# Altium schematic sheet Adapter.SchDoc
size A4
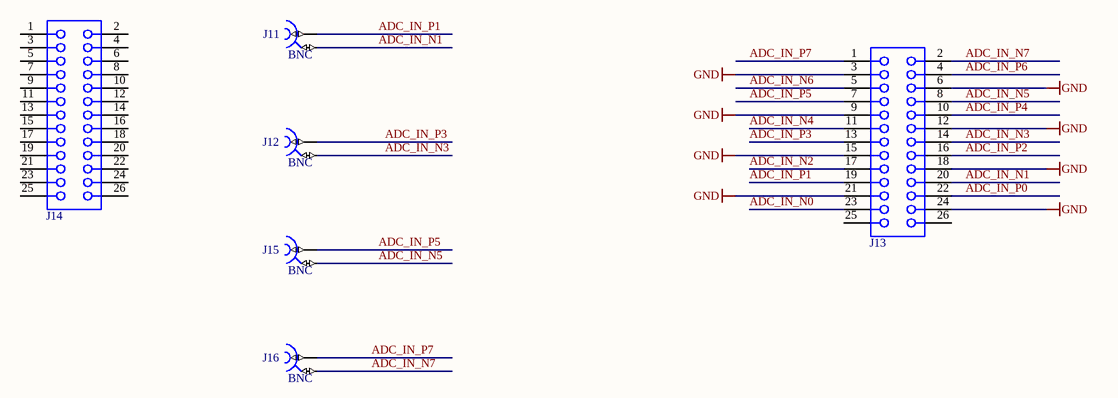
[diagram p0: Adapter.SchDoc]

## Parts
J11  BNC  [MOLEX_73251-3150]
J12  BNC  [MOLEX_73251-3150]
J13  61032621821  [61032621821]  (value not drawn)
J14  61302621821  [61302621821]  (value not drawn)
J15  BNC  [MOLEX_73251-3150]
J16  BNC  [MOLEX_73251-3150]

## Nets
GND: J13.3 J13.6 J13.9 J13.12 J13.15 J13.18 J13.21 J13.24
ADC_IN_N0: J13.23
ADC_IN_N1: J11.2 J13.20
ADC_IN_N2: J13.17
ADC_IN_N3: J12.2 J13.14
ADC_IN_N4: J13.11
ADC_IN_N5: J13.8 J15.2
ADC_IN_N6: J13.5
ADC_IN_N7: J13.2 J16.2
ADC_IN_P0: J13.22
ADC_IN_P1: J11.1 J13.19
ADC_IN_P2: J13.16
ADC_IN_P3: J12.1 J13.13
ADC_IN_P4: J13.10
ADC_IN_P5: J13.7 J15.1
ADC_IN_P6: J13.4
ADC_IN_P7: J13.1 J16.1

Not connected (* = marked no-connect by the designer): J13 25 26; J14 1 2 3 4 5 6 7 8 9 10 11 12 13 14 15 16 17 18 19 20 21 22 23 24 25 26

## Library data of the parts
J11 J12 J15 J16 = MOLEX_73251-3150: Part Description: RF Connectors / Coaxial Connectors BNC RA PCB RECPT 50 OHM; Manufacturer: MOLEX; PressFit: No; Part Number: MOLEX_73251-3150; Component Kind: Standard; Component Type: Standard; Pin Count: 5; Family: BNC; Mounted: Yes; Socket: No; SMD: No; Sense: No; Status: None; Manufacturer Part Number: 73251-3150; HelpURL: \\cern.ch\dfs\Applications\Altium\Datasheets\MOLEX_73251-2121.pdf; Author: CERN DEM JLC; CreateDate: 19.09.2024; LatestRevisionDate: 19.09.2024
J13 = 61032621821: WR-PHD Socket Header, SMT, Vertical, pitch 2.54mm, 2 Row, 26P; Manufacturer: Wurth Elektronik; Contact Resistance: 20mOhm; Rated Current: 3A; Working Voltage: 250V; Withstanding Voltage: 600V; Manufacturer Part Number: 61032621821; Category: Board-to-Board Connectors; Match Code: WR-PHD; ComponentLink1Description: Website Link; ComponentLink1URL: https://www.we-online.com/redexpert/article/61032621821?ad; ComponentLink2Description: Datasheet Link; ComponentLink2URL: https://www.we-online.com/redexpert/spec/61032621821?ad; Mount: Surface Mount; Operating Temperature Max: 105°C; Operating Temperature Min: -40°C; Packaging: Tape and Reel; Gender: Socket Header; Number of Pins: 26; Number of Rows: 2; Orientation: Vertical; Pitch: 2.54mm
J14 = 61302621821: WR-PHD Socket Header, THT, Vertical, pitch 2.54mm, 2 Row, 26P; Manufacturer: Wurth Elektronik; Contact Resistance: 20mOhm; Rated Current: 3A; Working Voltage: 250V; Withstanding Voltage: 500V; Manufacturer Part Number: 61302621821; Category: Board-to-Board Connectors; Match Code: WR-PHD; ComponentLink1Description: Website Link; ComponentLink1URL: https://www.we-online.com/redexpert/article/61302621821?ad; ComponentLink2Description: Datasheet Link; ComponentLink2URL: https://www.we-online.com/redexpert/spec/61302621821?ad; Mount: Through Hole; Operating Temperature Max: 125°C; Operating Temperature Min: -40°C; Packaging: Tray; Gender: Socket Header; Number of Pins: 26; Number of Rows: 2; Orientation: Vertical; Pitch: 2.54mm